# Altium schematic sheet Linkwitz_Transform.SchDoc
size A4
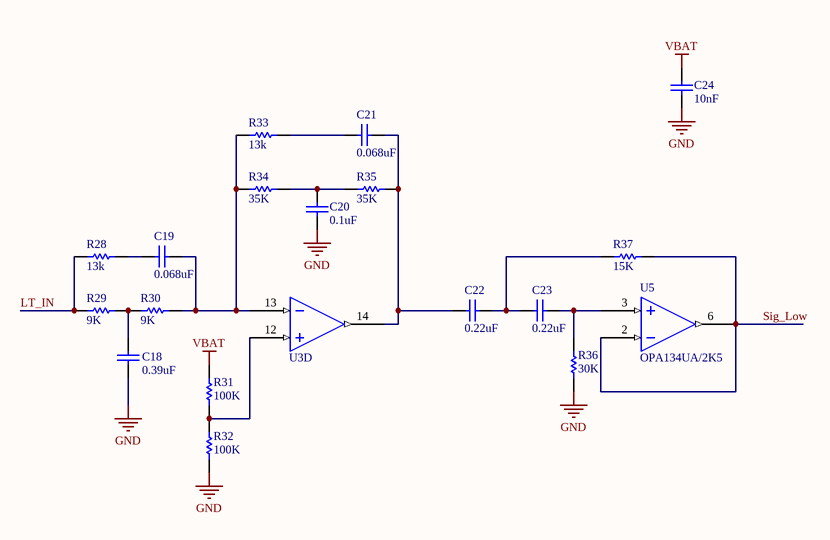
[diagram p0: Linkwitz_Transform.SchDoc]

## Parts
C18  0.39uF
C19  0.068uF  [CAP1913]
C20  0.1uF  [CAP1913]
C21  0.068uF  [CAP1913]
C22  0.22uF  [CAP FILM 1UF RADIAL 5MM]
C23  0.22uF  [CAP FILM 1UF RADIAL 5MM]
C24  10nF  [CAPC1608X09N]
R28  13k  [RESC1608X06N]
R29  9K  [RESC1608X06N]
R30  9K  [RESC1608X06N]
R31  100K  [RESC1608X06N]
R32  100K  [RESC1608X06N]
R33  13k  [RESC1608X06N]
R34  35K  [RESC1608X06N]
R35  35K  [RESC1608X06N]
R36  30K  [RESC1608X06N]
R37  15K  [RESC1608X06N]
U3  OPA4134UA  [SOIC127P600X175-14N]  (value not drawn)  (part D of 4)
U5  OPA134UA/2K5  [SOIC127P600X175-8N]

## Nets
GND: C18.1 C20.2 C24.1 R32.1 R36.1 U3.11(V-) U5.4(V-)
VBAT: C24.2 R31.2 U3.4(V+) U5.7(V+)
LT_IN: R28.1 R29.1
Sig_Low: R37.2 U5.2(-In_A) U5.6(Out)
NetC18_2: C18.2 R29.2 R30.1
NetC19_1: C19.1 R28.2
NetC19_2: C19.2 R30.2 R33.1 R34.1 U3.13(-In_D)
NetC20_1: C20.1 R34.2 R35.1
NetC21_1: C21.1 R33.2
NetC21_2: C21.2 C22.1 R35.2 U3.14(Out_D)
NetC22_2: C22.2 C23.1 R37.1
NetC23_2: C23.2 R36.2 U5.3(+In_A)
NetR31_1: R31.1 R32.2 U3.12(+In_D)

## Library data of the parts
C18 = CAP 0.39uF Radial 5mm: Manufacturer: EPCOS (TDK); Manufacturer P/N: B32529C105J; Voltage: 63V; Value: 0.39uF; Digikey Part Number: 495-4846-1-ND
C19 C21 = Capacitor 0.068uF 1913: Value: 0.068uF; Digikey Part Number: PCF1550CT-ND
C20 = Capacitor 0.1uF 1913: Value: 0.1uF; Digikey Part Number: PCF1552CT-ND
C22 C23 = CAP 0.22uF Radial 5mm: Manufacturer: EPCOS (TDK); Voltage: 100V; Value: 0.22uF; Digikey Part Number: 495-4985-1-ND
C24 = Capacitor 10nF 0603: Capacitor 2.2nF 0805; Value: 10nF; Digikey Part Number: 311-1085-1-ND
R28 R33 = RES 13K 0603: Tolerance: 1%; Type: RES; Footprint: 0603; Value: 13k
R29 R30 = RES 9K 0603: Tolerance: 1%; Type: RES; Footprint: 0603; Value: 9K
R31 R32 = RES 100K 0603: Tolerance: 1%; Power: 0.1W; Footprint: 0603; Value: 100K
R34 R35 = RES 35K 0603: Tolerance: 1%; Type: RES; Footprint: 0603; Value: 35K
R36 = RES 30K 0603: Tolerance: 1%; Type: RES; Footprint: 0603; Value: 30K
R37 = RES 15K 0306: Tolerance: 1%; Type: RES; Footprint: 0603; Value: 15K
U3 = OPA4134UA: Quad OPAx134 Operational Amplifier
U5 = OPA134UA/2K5: Digikey Part Number: 296-26241-1-ND